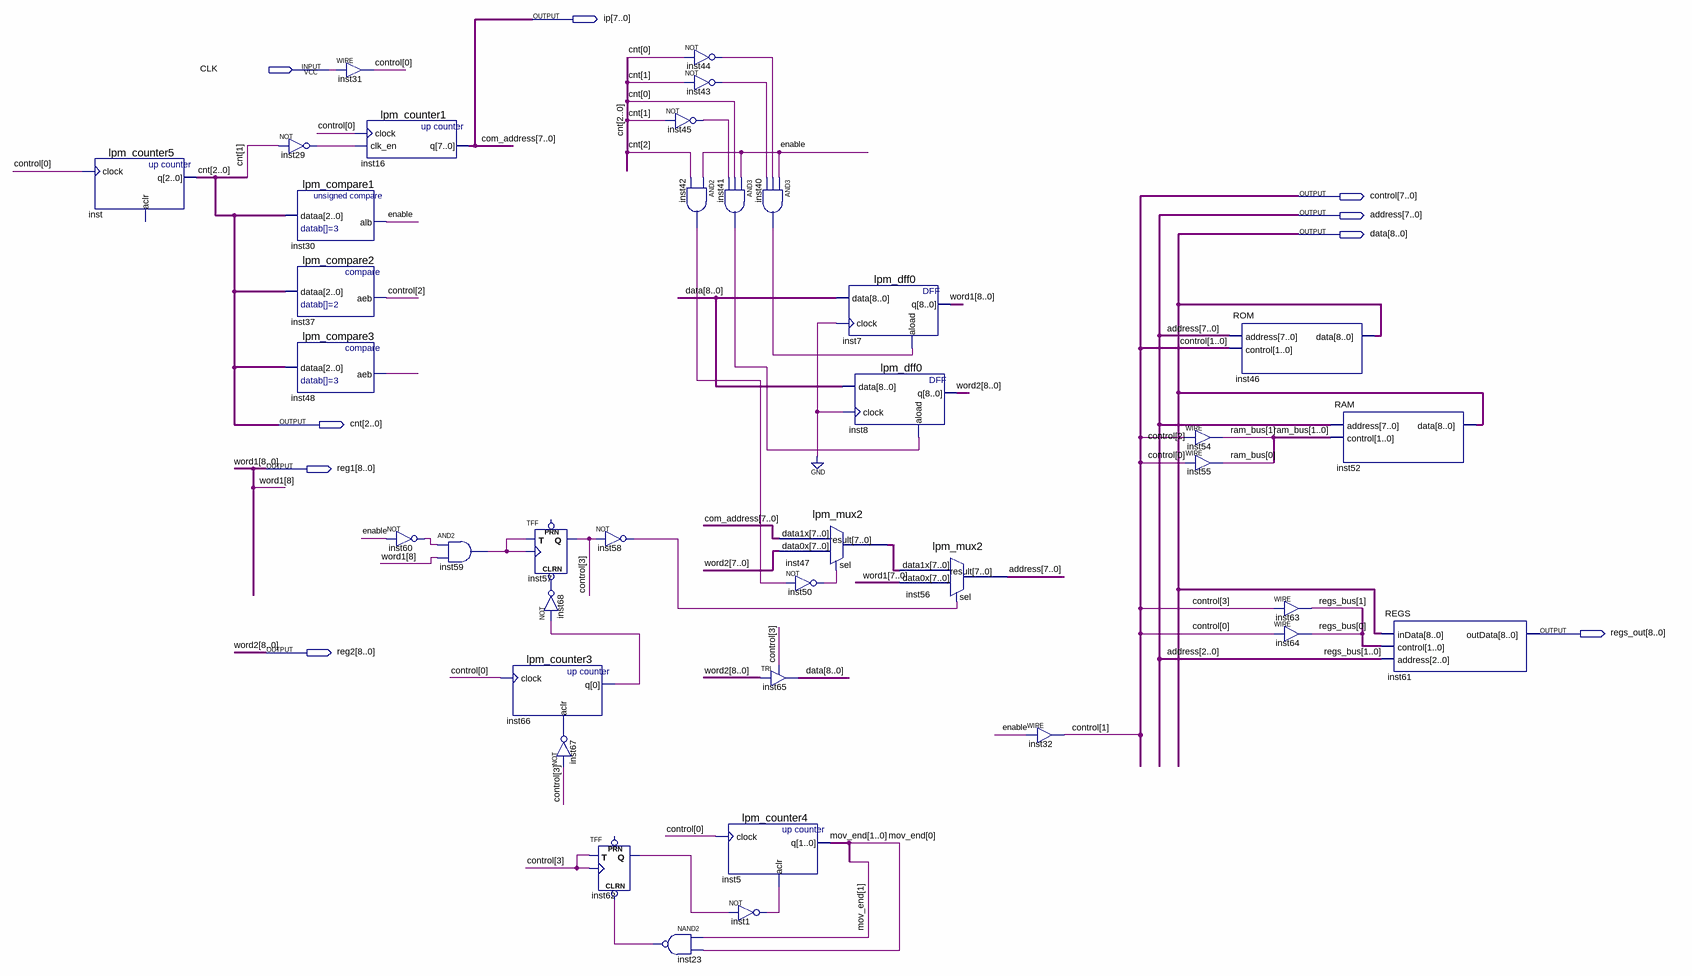
[diagram p0: schematic sheet]
// Quartus schematic main.bdf as structural Verilog: 38 symbols, 9 pins
module main (
  input  CLK,
  output [7:0] ip,
  output [7:0] control,
  output [7:0] address,
  output [8:0] data,
  output [2:0] cnt,
  output [8:0] reg1,
  output [8:0] regs_out,
  output [8:0] reg2
);

  wire enable, inst1_out, inst23_out, inst29_out, inst40_out, inst41_out, inst42_out, inst43_out, inst44_out,
       inst45_out, inst48_aeb, inst50_out, inst58_out, inst59_out, inst60_out, inst62_q, inst66_q,
       inst67_out, inst68_out;
  wire [1:0] mov_end, ram_bus, regs_bus;
  wire [7:0] inst47_result;

  lpm_counter5 inst (.clock(control[0]), .q(cnt));  // open: aclr
  not inst29 (inst29_out, cnt[1]);
  lpm_compare1 inst30 (.dataa(cnt), .alb(enable));
  lpm_compare2 inst37 (.dataa(cnt), .aeb(control[2]));
  lpm_compare3 inst48 (.dataa(cnt), .aeb(inst48_aeb));
  assign control[0] = CLK;  // WIRE inst31
  lpm_counter1 inst16 (.clock(control[0]), .clk_en(inst29_out), .q(ip));
  not inst60 (inst60_out, enable);
  and inst59 (inst59_out, inst60_out, reg1[8]);
  TFF inst57 (.CLRN(inst68_out), .T(inst59_out), .CLK(inst59_out), .Q(control[3]));  // open: PRN
  not inst68 (inst68_out, inst66_q);
  lpm_counter3 inst66 (.clock(control[0]), .aclr(inst67_out), .q(inst66_q));
  not inst67 (inst67_out, control[3]);
  TFF inst62 (.CLRN(inst23_out), .T(control[3]), .CLK(control[3]), .Q(inst62_q));  // open: PRN
  not inst58 (inst58_out, control[3]);
  not inst44 (inst44_out, cnt[0]);
  not inst43 (inst43_out, cnt[1]);
  not inst45 (inst45_out, cnt[1]);
  and inst42 (inst42_out, enable, cnt[2]);
  nand inst23 (inst23_out, mov_end[1], mov_end[0]);
  and inst41 (inst41_out, enable, cnt[0], inst45_out);
  lpm_counter4 inst5 (.clock(control[0]), .aclr(inst1_out), .q(mov_end));
  not inst1 (inst1_out, inst62_q);
  and inst40 (inst40_out, enable, inst44_out, inst43_out);
  lpm_mux2 inst47 (.data1x(ip), .data0x(reg2[7:0]), .sel(inst50_out), .result(inst47_result));
  not inst50 (inst50_out, inst42_out);
  TRI inst65[8:0] (.IN(reg2), .OE(control[3]), .OUT(data));
  lpm_dff0 inst7 (.data(data), .clock(1'b0), .aload(inst40_out), .q(reg1));
  lpm_dff0 inst8 (.data(data), .clock(1'b0), .aload(inst41_out), .q(reg2));
  lpm_mux2 inst56 (.data1x(inst47_result), .data0x(reg1[7:0]), .sel(inst58_out), .result(address));
  assign control[1] = enable;  // WIRE inst32
  assign ram_bus[1] = control[2];  // WIRE inst54
  assign ram_bus[0] = control[0];  // WIRE inst55
  ROM inst46 (.address(address), .control(control[1:0]), .data(data));
  assign regs_bus[1] = control[3];  // WIRE inst63
  assign regs_bus[0] = control[0];  // WIRE inst64
  RAM inst52 (.address(address), .control(ram_bus), .data(data));
  REGS inst61 (.inData(data), .control(regs_bus), .address(address[2:0]), .outData(regs_out));

  // Other names for the same wires on the sheet: com_address[7:0] = ip; word1[8:0] = reg1; word2[8:0] = reg2
endmodule
